# Altium schematic sheet Charger.SchDoc
size Tabloid; Organization: Altium Limited; Address1: L3, 12a Rodborough Rd; Address2: Frenchs Forest; Address3: NSW; Address4: Australia 2086; DocumentNumber: 3; SheetNumber: 3; SheetTotal: 8
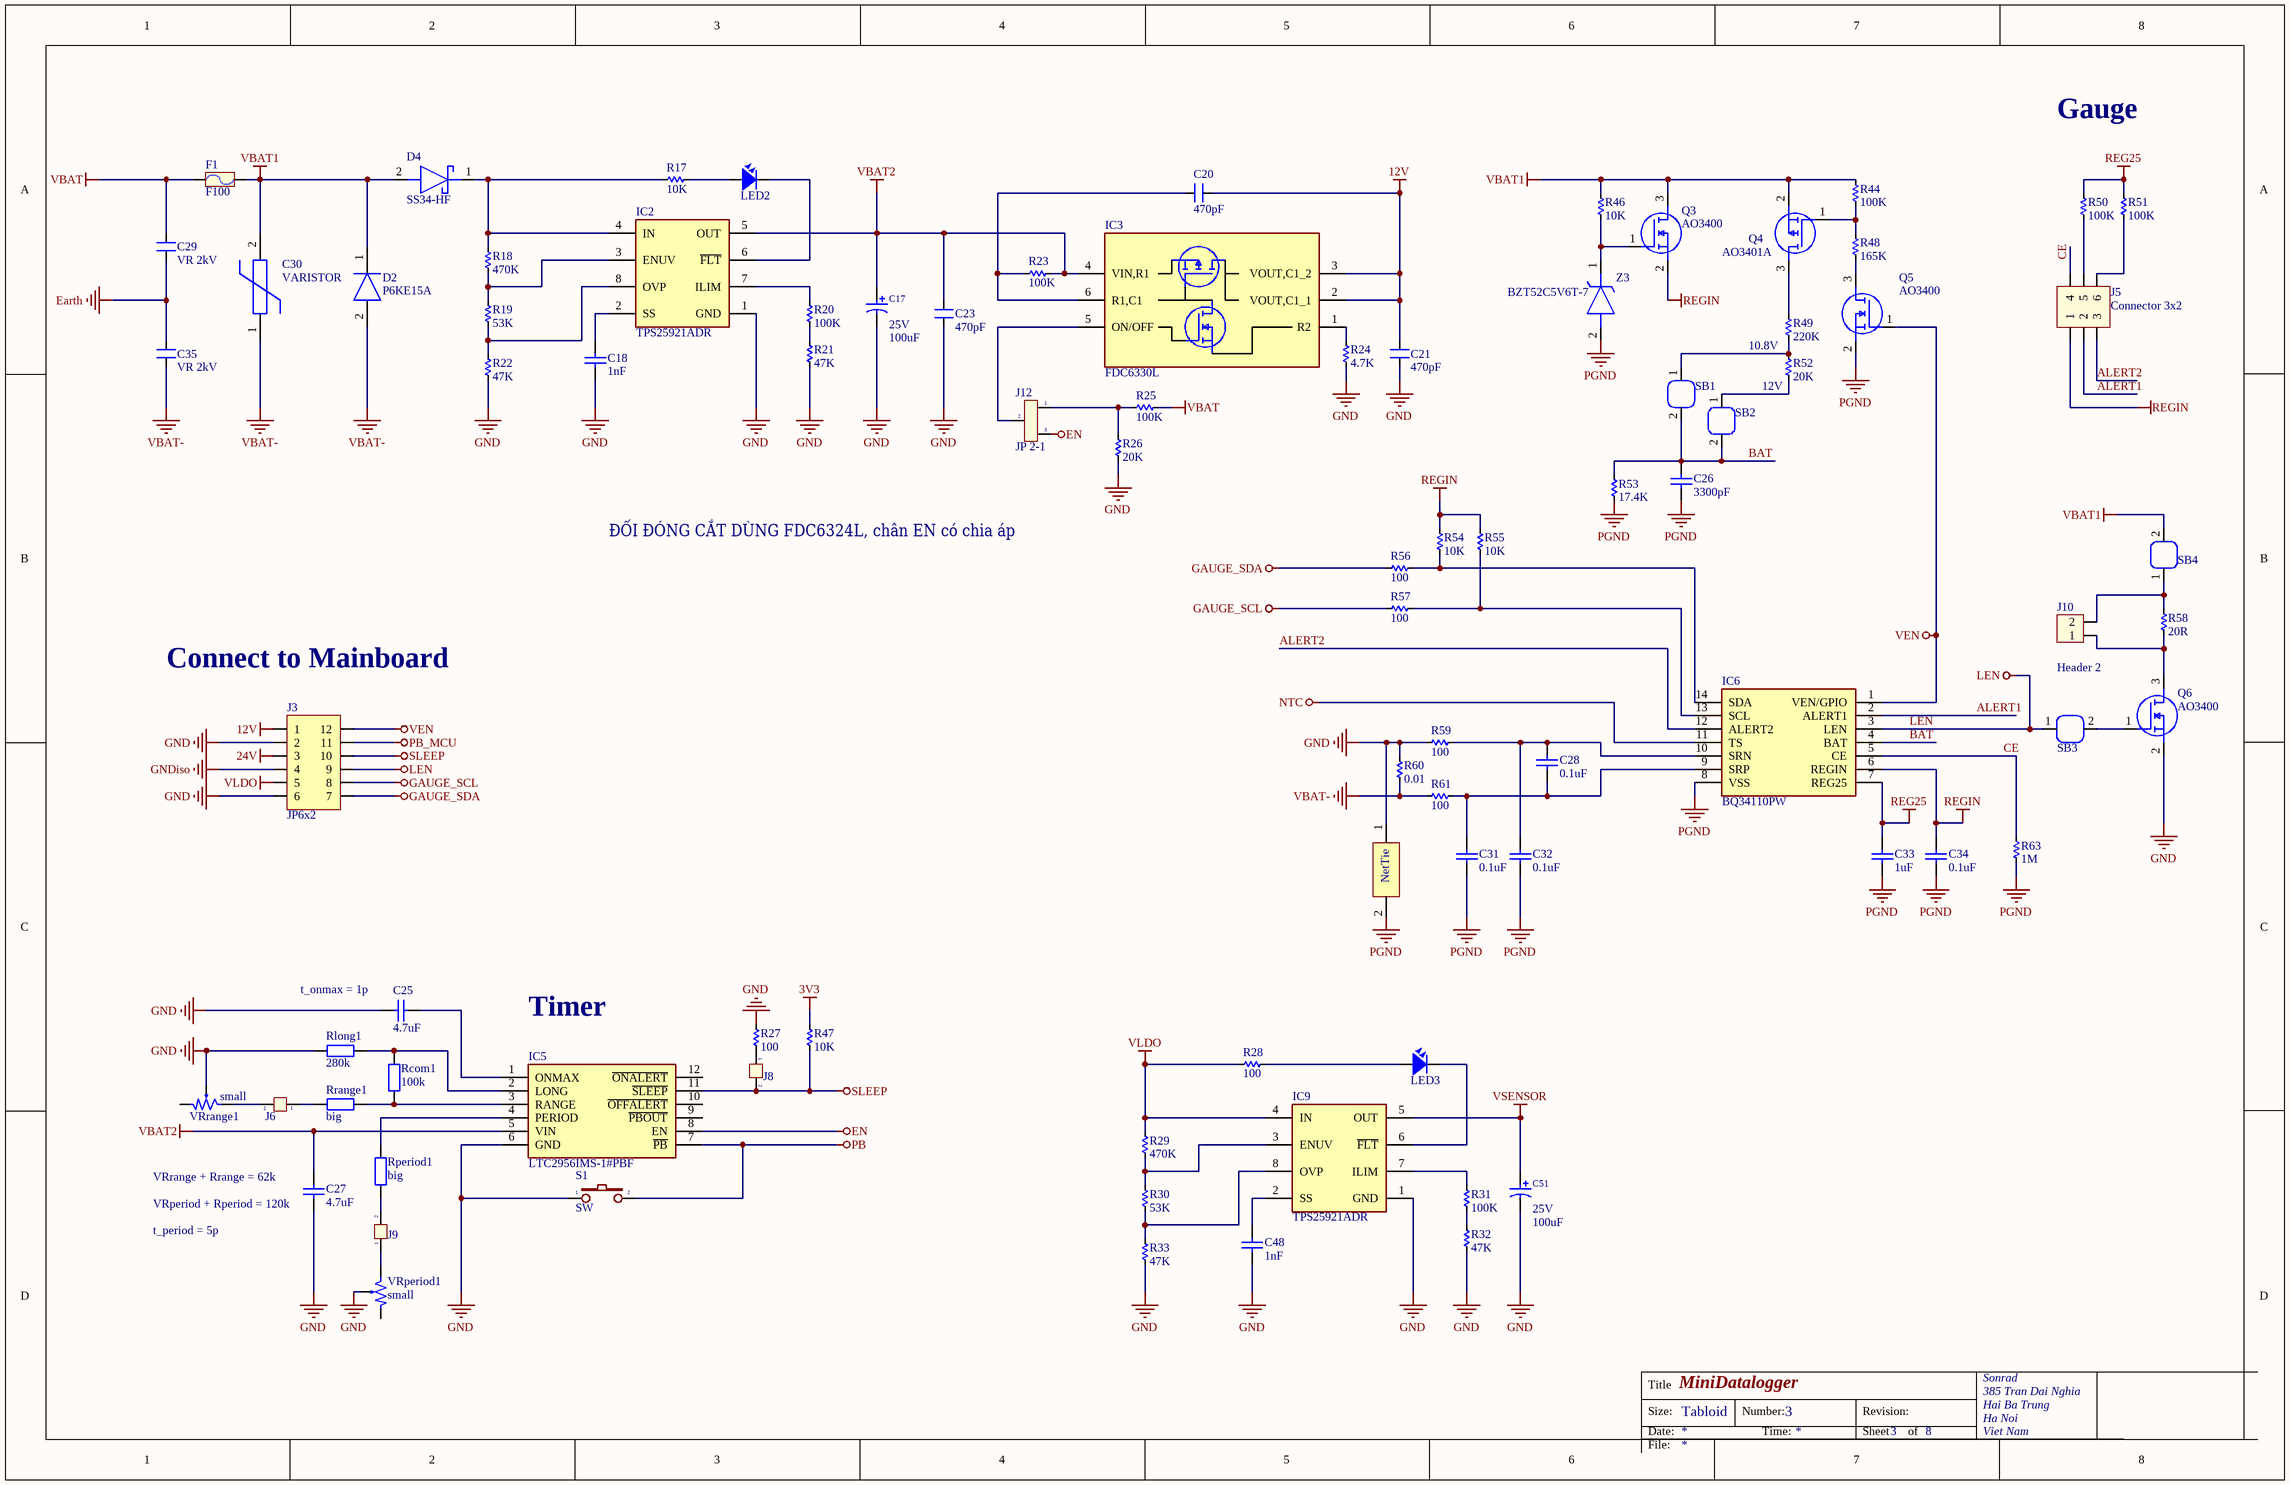
[diagram p0: Charger.SchDoc]

## Parts
*  NetTie  [NetTie]  (value not drawn)
C17  value 100uF  Volt: 25V  [Cap SMD Tant]  (hidden comment: 100 uF 25V)
C18  1nF  [0805 CAP]
C20  470pF  [SM-0805]
C21  470pF  [SM-0805]
C23  470pF  [SM-0805]
C25  4.7uF  [0805 CAP]
C26  3300pF  [0805 CAP]
C27  4.7uF  [0805 CAP]
C28  0.1uF  [0805 CAP]
C29  VR 2kV  [CN3]
C30  VARISTOR  [CN2]
C31  0.1uF  [0805 CAP]
C32  0.1uF  [0805 CAP]
C33  1uF  [0805 CAP]
C34  0.1uF  [0805 CAP]
C35  VR 2kV  [CN3]
C48  1nF  [0805 CAP]
C51  value 100uF  Volt: 25V  [Cap SMD Tant]  (hidden comment: 100 uF 25V)
D2  P6KE15A  [P6KE15A]
D4  SS34-HF  [DIOM5025X220N]
F1  F100  [Fuse1A]
IC2  TPS25921ADR  [SOIC127P600X175-8N]
IC3  FDC6330L  [SOT95P280X110-6N]
IC5  LTC2956IMS-1#PBF  [SOP65P490X110-12N]
IC6  BQ34110PW  [SOP65P640X120-14N]
IC9  TPS25921ADR  [SOIC127P600X175-8N]
J3  JP6x2  [JP6-D2T]
J5  Connector 3x2  [JP3x2]
J6  Jumper 2  [JP2]  (value not drawn)
J8  Jumper 2  [JP2]  (value not drawn)
J9  Jumper 2  [JP2]  (value not drawn)
J10  Header 2  [HED2B]
J12  JP 2-1  [JP3]
LED2  LED  [LED 3512]  (value not drawn)
LED3  LED  [LED 3512]  (value not drawn)
Q3  AO3400  [SOT95P280X125-3N]
Q4  AO3401A  [SOT95P280X125-3N]
Q5  AO3400  [SOT95P280X125-3N]
Q6  AO3400  [SOT95P280X125-3N]
R17  10K  [RES-SMD-0805]
R18  470K  [RES-SMD-0805]
R19  53K  [RES-SMD-0805]
R20  100K  [RES-SMD-0805]
R21  47K  [RES-SMD-0805]
R22  47K  [RES-SMD-0805]
R23  100K  [RES-SMD-0805]
R24  4.7K  [RES-SMD-0805]
R25  100K  [RES-SMD-0805]
R26  20K  [RES-SMD-0805]
R27  100  [RES-SMD-0805]
R28  100  [RES-SMD-0805]
R29  470K  [RES-SMD-0805]
R30  53K  [RES-SMD-0805]
R31  100K  [RES-SMD-0805]
R32  47K  [RES-SMD-0805]
R33  47K  [RES-SMD-0805]
R44  100K  [RES-SMD-0805]
R46  10K  [RES-SMD-0805]
R47  10K  [RES-SMD-0805]
R48  165K  [RES-SMD-0805]
R49  220K  [RES-SMD-0805]
R50  100K  [RES-SMD-0805]
R51  100K  [RES-SMD-0805]
R52  20K  [RES-SMD-0805]
R53  17.4K  [RES-SMD-0805]
R54  10K  [RES-SMD-0805]
R55  10K  [RES-SMD-0805]
R56  100  [RES-SMD-0805]
R57  100  [RES-SMD-0805]
R58  20R  [RES-SMD-2512]
R59  100  [RES-SMD-0805]
R60  0.01  [RES-SMD-1210]
R61  100  [RES-SMD-0805]
R63  1M  [RES-SMD-0805]
Rcom1  100k  [0805 RESISTOR]
Rlong1  280k  [0805 RESISTOR]
Rperiod1  big  [0805 RESISTOR]
Rrange1  big  [0805 RESISTOR]
S1  SW  [SW2]
SB1  Solder bridge  [Solder Bridge]  (value not drawn)
SB2  Solder bridge  [Solder Bridge]  (value not drawn)
SB3  Solder bridge  [Solder Bridge]  (value not drawn)
SB4  Solder bridge  [Solder Bridge]  (value not drawn)
VRperiod1  small  [VR1]
VRrange1  small  [VR1]
Z3  BZT52C5V6T-7  [SODFL1608X65N]

## Nets
3V3: R47.2
12V: C20.2 C21.1 IC3.2(VOUT,C1_1) IC3.3(VOUT,C1_2) J3.1
24V: J3.3
Earth: C29.1 C35.2
EN: IC5.8(EN) J12.3
GAUGE_SCL: J3.8 R57.1
GAUGE_SDA: J3.7 R56.1
GND: *.1 C17.2 C18.2 C21.2 C23.2 C25.2 C27.1 C48.2 C51.2 IC2.1(GND) IC5.6(GND) IC9.1(GND) J3.2 J3.6 Q6.2(S) R21.1 R22.1 R24.1 R26.1 R27.2 R32.1 R33.1 R59.1 R60.1 Rlong1.1 S1.1 VRperiod1.2 VRrange1.2
GNDiso: J3.4
LEN: IC6.3(LEN) J3.9 SB3.1
NTC: IC6.11(TS)
PB: IC5.7(~{PB}) S1.2
PB_MCU: J3.11
PGND: *.2 C26.1 C31.1 C32.1 C33.1 C34.1 IC6.8(VSS) Q5.2(S) R53.1 R63.1 Z3.2(A)
REG25: C33.2 IC6.7(REG25) R50.2 R51.2
REGIN: C34.2 IC6.6(REGIN) J5.1 Q3.2(S) R54.2 R55.2
SLEEP: IC5.11(~{SLEEP}) J3.10 J8.2 R47.1
VBAT: C29.2 F1.1 R25.1
VBAT1: C30.2 D2.1(K) D4.2(A) F1.2 Q3.3(D) Q4.2(S) R44.2 R46.2 SB4.2
VBAT2: C17.1 C23.1 C27.2 IC2.5(OUT) IC3.4(VIN,R1) IC5.5(VIN) R23.1
VBAT-: C30.1 C35.1 D2.2(A) R60.2 R61.1
VEN: IC6.1(VEN/GPIO) J3.12 Q5.1(G)
VLDO: IC9.4(IN) J3.5 R28.1 R29.2
VSENSOR: C51.1 IC9.5(OUT)
ALERT1: IC6.2(ALERT1) J5.5(2)
ALERT2: IC6.12(ALERT2) J5.6(3)
BAT: C26.2 IC6.4(BAT) R53.2 SB1.2 SB2.2
CE: IC6.5(CE) J5.4 R63.2
NetC18_1: C18.1 IC2.2(SS)
NetC20_1: C20.1 IC3.6(R1,C1) R23.2
NetC25_1: C25.1 IC5.1(ONMAX)
NetC28_1: C28.1 C31.2 IC6.9(SRP) R61.2
NetC28_2: C28.2 C32.2 IC6.10(SRN) R59.2
NetC48_1: C48.1 IC9.2(SS)
NetD4_1: D4.1(K) IC2.4(IN) R17.1 R18.2
NetIC2_3: IC2.3(ENUV) R18.1 R19.2
NetIC2_6: IC2.6(~{FLT}) LED2.2
NetIC2_7: IC2.7(ILIM) R20.2
NetIC2_8: IC2.8(OVP) R19.1 R22.2
NetIC3_1: IC3.1(R2) R24.2
NetIC3_5: IC3.5(ON/OFF) J12.2
NetIC5_2: IC5.2(LONG) Rcom1.2 Rlong1.2
NetIC5_3: IC5.3(RANGE) Rcom1.1 Rrange1.2
NetIC5_4: IC5.4(PERIOD) Rperiod1.2
NetIC6_13: IC6.13(SCL) R55.1 R57.2
NetIC6_14: IC6.14(SDA) R54.1 R56.2
NetIC9_3: IC9.3(ENUV) R29.1 R30.2
NetIC9_6: IC9.6(~{FLT}) LED3.2
NetIC9_7: IC9.7(ILIM) R31.2
NetIC9_8: IC9.8(OVP) R30.1 R33.2
NetJ5_2: J5.2(5) R50.1
NetJ5_3: J5.3(6) R51.1
NetJ6_1: J6.1 Rrange1.1
NetJ6_2: J6.2 VRrange1.3
NetJ8_1: J8.1 R27.1
NetJ9_1: J9.1 VRperiod1.3
NetJ9_2: J9.2 Rperiod1.1
NetJ10_1: J10.1 Q6.3(D) R58.1
NetJ10_2: J10.2 R58.2 SB4.1
NetJ12_1: J12.1 R25.2 R26.2
NetLED2_1: LED2.1 R17.2
NetLED3_1: LED3.1 R28.2
NetQ3_1: Q3.1(G) R46.1 Z3.1(K)
NetQ4_1: Q4.1(G) R44.1 R48.2
NetQ4_3: Q4.3(D) R49.2
NetQ5_3: Q5.3(D) R48.1
NetQ6_1: Q6.1(G) SB3.2
NetR20_1: R20.1 R21.2
NetR31_1: R31.1 R32.2
NetR49_1: R49.1 R52.2 SB1.1
NetR52_1: R52.1 SB2.1

Not connected (* = marked no-connect by the designer): IC5 9(~{PBOUT}) 10(~{OFFALERT}) 12(~{ONALERT}); VRperiod1 1; VRrange1 1

## Notes on the sheet
- Gauge
- 10.8V
- (near R52) 12V
- ĐỔI ĐÓNG CẮT DÙNG FDC6324L, chân EN có chia áp
- Connect to Mainboard
- (near C25) t_onmax = 1p
- Timer
- (near C27) VRrange + Rrange = 62k
- (near C27) VRperiod + Rperiod = 120k
- t_period = 5p
- Title
- Size:
- Date:
- MiniDatalogger
- Tabloid
- Number:
- Time:
- Revision:
- Sheet
- of
- Sonrad
- 385 Tran Dai Nghia
- Hai Ba Trung
- Ha Noi
- Viet Nam
- File:

## Library data of the parts
C17 C51 = Cap_Pol: Polarized Tanta Capacitor; Manufacturer: FARNELL; AEMS Code: 2100110; Vendor: Digikey; Published: 13-April-2009; Publisher: Hoang Nguyen; ComponentLink1Description: Digikey Part Link; ComponentLink2Description: Open Datasheet; ComponentLink2URL: H:\LIBRARY\LIBRARY.Datasheet\
C18 C25-C28 C31-C34 C48 = CAP CERAMIC: Published: 8-Jun-2000; LatestRevisionDate: 17-Jul-2002; LatestRevisionNote: Re-released for DXP Platform.; PackageReference: RAD-0.3; Publisher: Altium Limited
C20 C21 C23 = CM: Cap SMD; Value: 103
C29 C35 = CN3: MOV; Value: 0,047uF; Copyright: VanDungEvn
C30 = VARISTOR: Value: VR 10K
D2 = P6KE15A: Diode; Manufacturer_Name: STMicroelectronics; Datasheet Link: http://www.st.com/web/en/resource/technical/document/datasheet/CD00000720.pdf; Manufacturer_Part_Number: P6KE15A; Mouser Part Number: 511-P6KE15A; Mouser Price/Stock: https://www.mouser.co.uk/ProductDetail/STMicroelectronics/P6KE15A?qs=TGPpmpbSrT5hhHGF%252BJ4hqw%3D%3D; Arrow Part Number: P6KE15A; Arrow Price/Stock: https://www.arrow.com/en/products/p6ke15a/stmicroelectronics
D4 = SS34-HF: Schottky Diode; Manufacturer_Name: Comchip Technology; Datasheet Link: https://ms.componentsearchengine.com/Datasheets/1/SS34-HF.pdf; Height: 2.2mm; Manufacturer_Part_Number: SS34-HF; Mouser Part Number: 750-SS34-HF; Mouser Price/Stock: https://www.mouser.co.uk/ProductDetail/Comchip-Technology/SS34-HF?qs=%252B6g0mu59x7Kt0FF4l3l3pg%3D%3D; Arrow Part Number: SS34-HF; Arrow Price/Stock: https://www.arrow.com/en/products/ss34-hf/comchip-technology
F1 = Fuse: Designed by: VanDungEvn; Value: Fuse
IC2 IC9 = TPS25921ADR: Integrated Circuit; Manufacturer_Name: Texas Instruments; Datasheet Link: http://www.ti.com/lit/gpn/tps25921a; Height: 1.75mm; Manufacturer_Part_Number: TPS25921ADR; Mouser Part Number: 595-TPS25921ADR; Mouser Price/Stock: https://www.mouser.co.uk/ProductDetail/Texas-Instruments/TPS25921ADR?qs=m%2F7bTylgptfvwfVPRm0ALQ%3D%3D; Arrow Part Number: TPS25921ADR; Arrow Price/Stock: https://www.arrow.com/en/products/tps25921adr/texas-instruments
IC3 = FDC6330L: Integrated Circuit; Manufacturer_Name: ON Semiconductor; Datasheet Link: http://docs-emea.rs-online.com/webdocs/10df/0900766b810df4e7.pdf; Height: 1.1mm; Manufacturer_Part_Number: FDC6330L; Mouser Part Number: 512-FDC6330L; Mouser Price/Stock: https://www.mouser.co.uk/ProductDetail/ON-Semiconductor-Fairchild/FDC6330L?qs=efMQ9B2bthfkfJJoj5%252B07g%3D%3D; Arrow Part Number: FDC6330L; Arrow Price/Stock: https://www.arrow.com/en/products/fdc6330l/on-semiconductor
IC5 = LTC2956IMS-1#PBF: Integrated Circuit; Manufacturer_Name: Analog Devices; Datasheet Link: https://componentsearchengine.com/Datasheets/1/LTC2956IMS-1#PBF.pdf; Height: 1.1mm; Manufacturer_Part_Number: LTC2956IMS-1#PBF; Mouser Part Number: 584-LTC2956IMS-1#PBF; Mouser Price/Stock: https://www.mouser.com/Search/Refine.aspx?Keyword=584-LTC2956IMS-1%23PBF; Arrow Part Number: LTC2956IMS-1#PBF; Arrow Price/Stock: https://www.arrow.com/en/products/ltc2956ims-1pbf/analog-devices
IC6 = BQ34110PW: Integrated Circuit; Manufacturer_Name: Texas Instruments; Datasheet Link: http://www.ti.com/lit/gpn/bq34110; Height: 1.2mm; Manufacturer_Part_Number: BQ34110PW; Mouser Part Number: 595-BQ34110PW; Mouser Price/Stock: https://www.mouser.co.uk/ProductDetail/Texas-Instruments/BQ34110PW?qs=OEYMhS7p3YbAd6vB%252BTGmNQ%3D%3D; Arrow Part Number: BQ34110PW; Arrow Price/Stock: https://www.arrow.com/en/products/bq34110pw/texas-instruments
J3 = JP6x2: WR-PHD 2.54 mm Dual Socket Header; Manufacturer: W¨¹rth Elektronik eiSos GmbH; partNo: 61301221821; ComponentLink1 Description: Manufacturer; ComponentLink2 Description: Datasheet; NoPins: 12; Created Date: 29 March 2013; ComponentLink1URL: http://www.we-online.com; ComponentLink2URL: http://katalog.we-online.de/em/datasheet/6130xx21821.pdf; Created by: Karrer Zheng
J5 = JP3x2: Value: Connector 3x2
J6 J8 J9 = JP 2: Value: JP 2
J10 = Hed2: Header 2 (Green); Value: Header 2
J12 = JP 2-1: Jumper 2-1; Value: J2-1
LED2 LED3 = LED SMD: Value: LED 3 - 5 ly 2 Colour
Q3 Q5 Q6 = AO3400: MOSFET (N-Channel); Manufacturer_Name: Alpha & Omega Semiconductors; Datasheet Link: http://aosmd.com/res/data_sheets/AO3400.pdf; Height: 1.25mm; Manufacturer_Part_Number: AO3400; Arrow Part Number: AO3400; Arrow Price/Stock: https://www.arrow.com/en/products/ao3400/alpha-and-omega-semiconductor
Q4 = AO3401A: MOSFET (P-Channel); Manufacturer_Name: Alpha & Omega Semiconductors; Datasheet Link: http://www.aosmd.com/pdfs/datasheet/AO3401A.pdf; Height: 1.25mm; Manufacturer_Part_Number: AO3401A; Arrow Part Number: AO3401A; Arrow Price/Stock: https://www.arrow.com/en/products/ao3401a/alpha-and-omega-semiconductor
R17-R33 R44 R46-R61 R63 = Res-SMD: Resistor; Manufacturer: Generic Components; Class: Passive; Published: 08/06/2000; Publisher: Altium Hobart Technology Centre
Rcom1 Rlong1 Rperiod1 Rrange1 = RESISTOR: Value: R1/4W - 1K
S1 = SW2: Switch button 2 pin; Value: SW chip 2 pin
VRperiod1 VRrange1 = VR1: Var Resistor; Value: VR 10K
Z3 = BZT52C5V6T-7: Zener Diode; Manufacturer_Name: Diodes Inc.; Datasheet Link: https://www.mouser.com/datasheet/2/115/ds30502-1142513.pdf; Height: 0.65mm; Manufacturer_Part_Number: BZT52C5V6T-7; Mouser Part Number: 621-BZT52C5V6T-7; Mouser Price/Stock: https://www.mouser.co.uk/ProductDetail/Diodes-Incorporated/BZT52C5V6T-7/?qs=zLeapIUCO8Tm%252BIuaCPAdkQ%3D%3D; Arrow Part Number: BZT52C5V6T-7; Arrow Price/Stock: https://www.arrow.com/en/products/bzt52c5v6t-7/diodes-incorporated